# Altium project 0021.PrjPcb
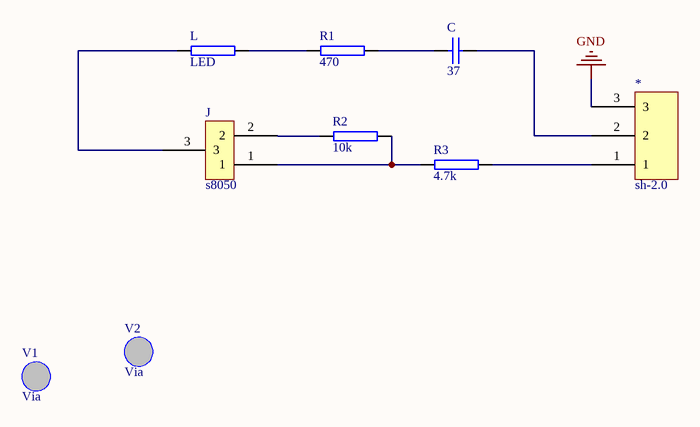
[diagram p0: 0021.SchDoc]
1 sheet, 9 parts. Net scope: global (net labels, ports and power ports of the same name join across sheets).
Board file: 0021.PcbDoc

## Sheet 0021.SchDoc
size A4

### Parts
*  sh-2.0  [sh-2.0]
C  37  [0402]
J  s8050  [SOT-23]
L  LED  [1206]
R1  470  [0402]
R2  10k  [0402]
R3  4.7k  [0402]
V1  Via  [Via]
V2  Via  [Via]

### Nets
GND: *.3
Net*_1: *.1 R3.2
Net*_2: *.2 C.2
NetC_1: C.1 R1.2
NetJ_1: J.1 R2.1 R3.1
NetJ_2: J.2 R2.2
NetJ_3: J.3 L.1
NetL_2: L.2 R1.1

### Library data of the parts
C = CAP0402
L = RES1206
R1-R3 = RES0402